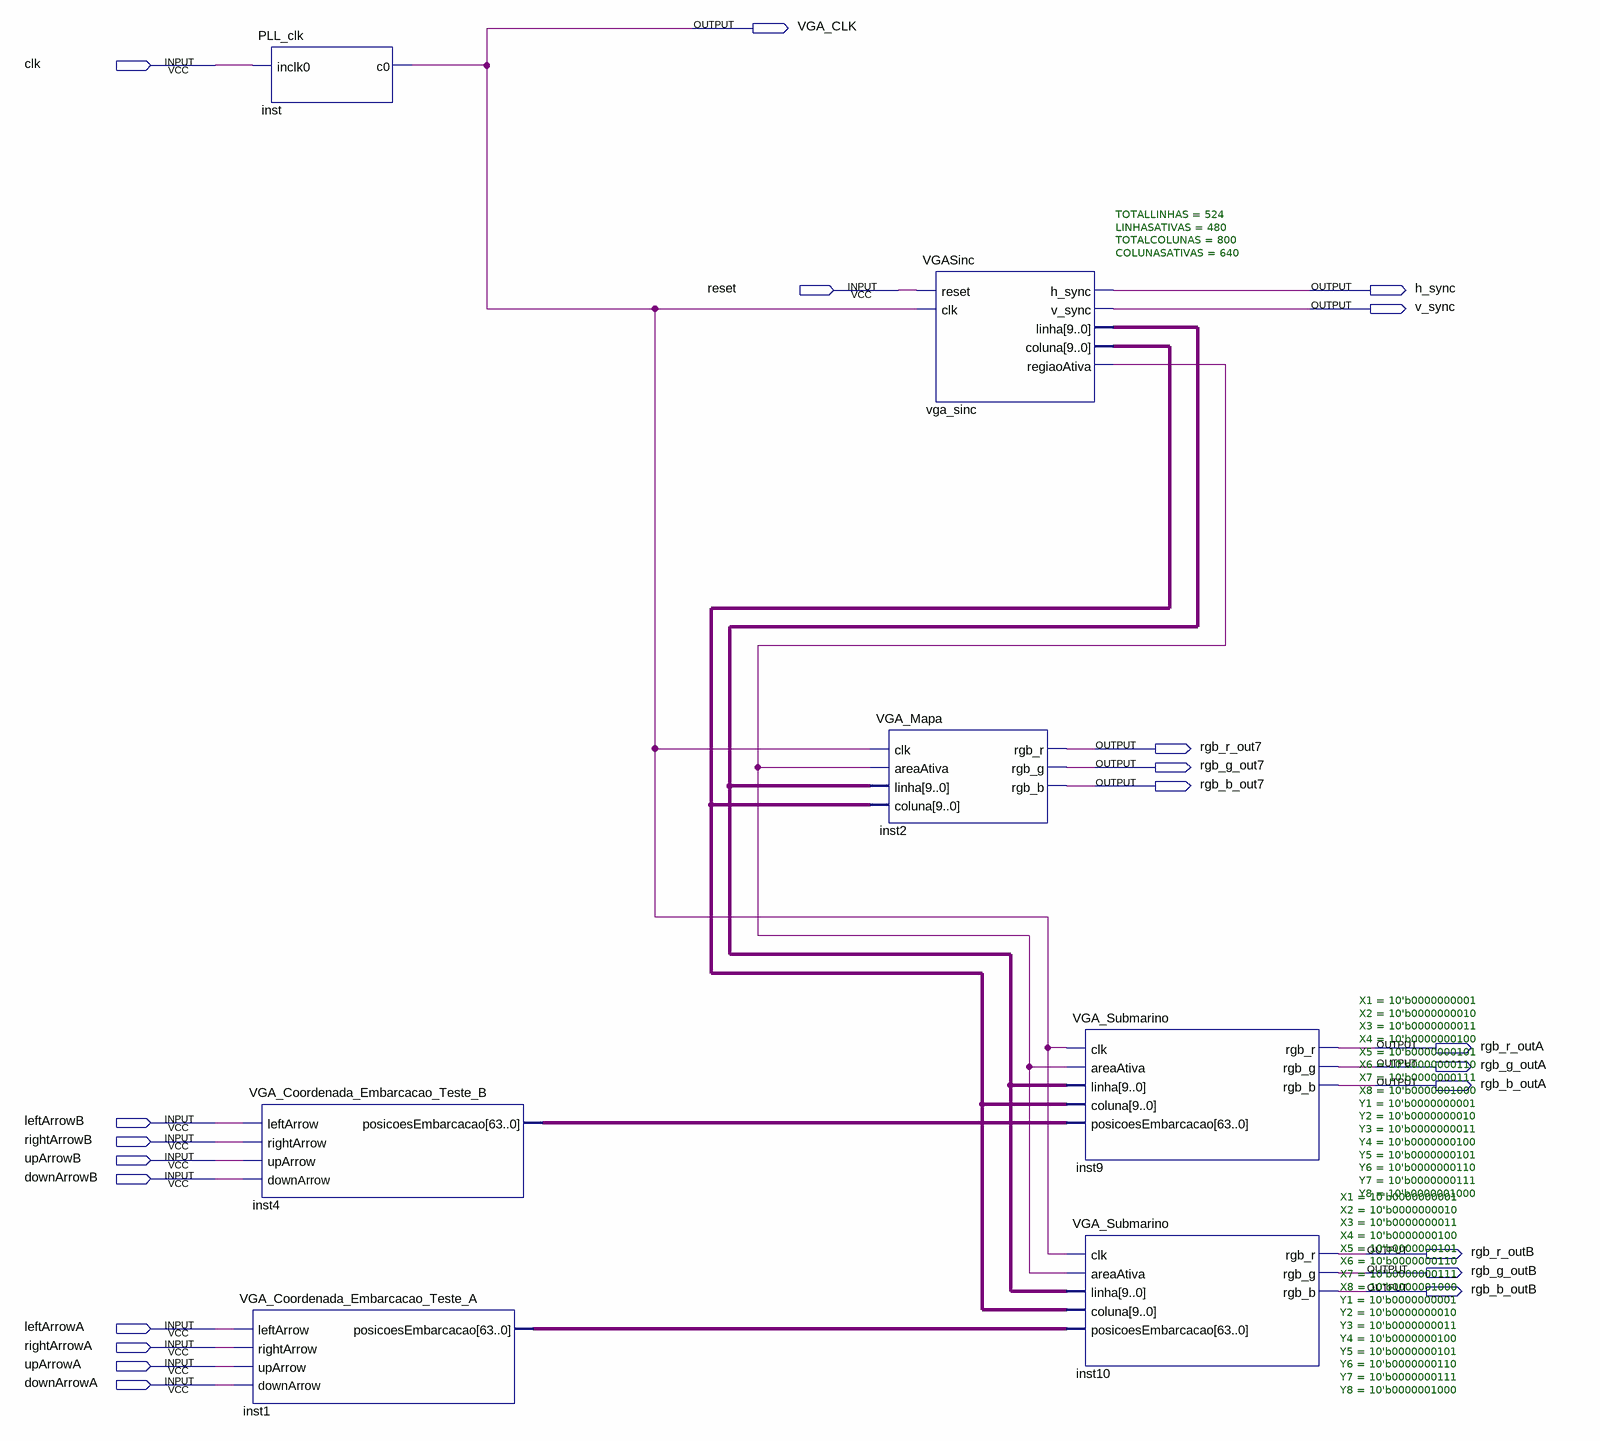
[diagram p0: schematic sheet]
// Quartus schematic VGA_TopLevel.bdf as structural Verilog: 7 symbols, 22 pins
module VGA_TopLevel (
  input  clk,
  input  reset,
  input  leftArrowB,
  input  rightArrowB,
  input  upArrowB,
  input  downArrowB,
  input  leftArrowA,
  input  rightArrowA,
  input  upArrowA,
  input  downArrowA,
  output VGA_CLK,
  output h_sync,
  output v_sync,
  output rgb_r_out7,
  output rgb_g_out7,
  output rgb_b_out7,
  output rgb_r_outA,
  output rgb_g_outA,
  output rgb_b_outA,
  output rgb_r_outB,
  output rgb_g_outB,
  output rgb_b_outB
);

  wire vga_sinc_regiaoativa;
  wire [9:0] vga_sinc_coluna, vga_sinc_linha;
  wire [63:0] inst1_posicoesembarcacao, inst4_posicoesembarcacao;

  PLL_clk inst (.inclk0(clk), .c0(VGA_CLK));
  VGA_Coordenada_Embarcacao_Teste_B inst4 (
    .leftArrow(leftArrowB), .rightArrow(rightArrowB), .upArrow(upArrowB), .downArrow(downArrowB),
    .posicoesEmbarcacao(inst4_posicoesembarcacao));
  VGA_Coordenada_Embarcacao_Teste_A inst1 (
    .leftArrow(leftArrowA), .rightArrow(rightArrowA), .upArrow(upArrowA), .downArrow(downArrowA),
    .posicoesEmbarcacao(inst1_posicoesembarcacao));
  VGASinc #(.TOTALLINHAS(524), .LINHASATIVAS(480), .TOTALCOLUNAS(800), .COLUNASATIVAS(640)) vga_sinc (
    .reset(reset), .clk(VGA_CLK), .h_sync(h_sync), .v_sync(v_sync), .linha(vga_sinc_linha),
    .coluna(vga_sinc_coluna), .regiaoAtiva(vga_sinc_regiaoativa));
  VGA_Mapa inst2 (
    .clk(VGA_CLK), .areaAtiva(vga_sinc_regiaoativa), .linha(vga_sinc_linha), .coluna(vga_sinc_coluna),
    .rgb_r(rgb_r_out7), .rgb_g(rgb_g_out7), .rgb_b(rgb_b_out7));
  VGA_Submarino #(.X1(10'b0000000001), .X2(10'b0000000010), .X3(10'b0000000011), .X4(10'b0000000100), .X5(10'b0000000101), .X6(10'b0000000110), .X7(10'b0000000111), .X8(10'b0000001000), .Y1(10'b0000000001), .Y2(10'b0000000010), .Y3(10'b0000000011), .Y4(10'b0000000100), .Y5(10'b0000000101), .Y6(10'b0000000110), .Y7(10'b0000000111), .Y8(10'b0000001000)) inst9 (
    .clk(VGA_CLK), .areaAtiva(vga_sinc_regiaoativa), .linha(vga_sinc_linha), .coluna(vga_sinc_coluna),
    .posicoesEmbarcacao(inst4_posicoesembarcacao), .rgb_r(rgb_r_outA), .rgb_g(rgb_g_outA), .rgb_b(rgb_b_outA));
  VGA_Submarino #(.X1(10'b0000000001), .X2(10'b0000000010), .X3(10'b0000000011), .X4(10'b0000000100), .X5(10'b0000000101), .X6(10'b0000000110), .X7(10'b0000000111), .X8(10'b0000001000), .Y1(10'b0000000001), .Y2(10'b0000000010), .Y3(10'b0000000011), .Y4(10'b0000000100), .Y5(10'b0000000101), .Y6(10'b0000000110), .Y7(10'b0000000111), .Y8(10'b0000001000)) inst10 (
    .clk(VGA_CLK), .areaAtiva(vga_sinc_regiaoativa), .linha(vga_sinc_linha), .coluna(vga_sinc_coluna),
    .posicoesEmbarcacao(inst1_posicoesembarcacao), .rgb_r(rgb_r_outB), .rgb_g(rgb_g_outB), .rgb_b(rgb_b_outB));
endmodule
